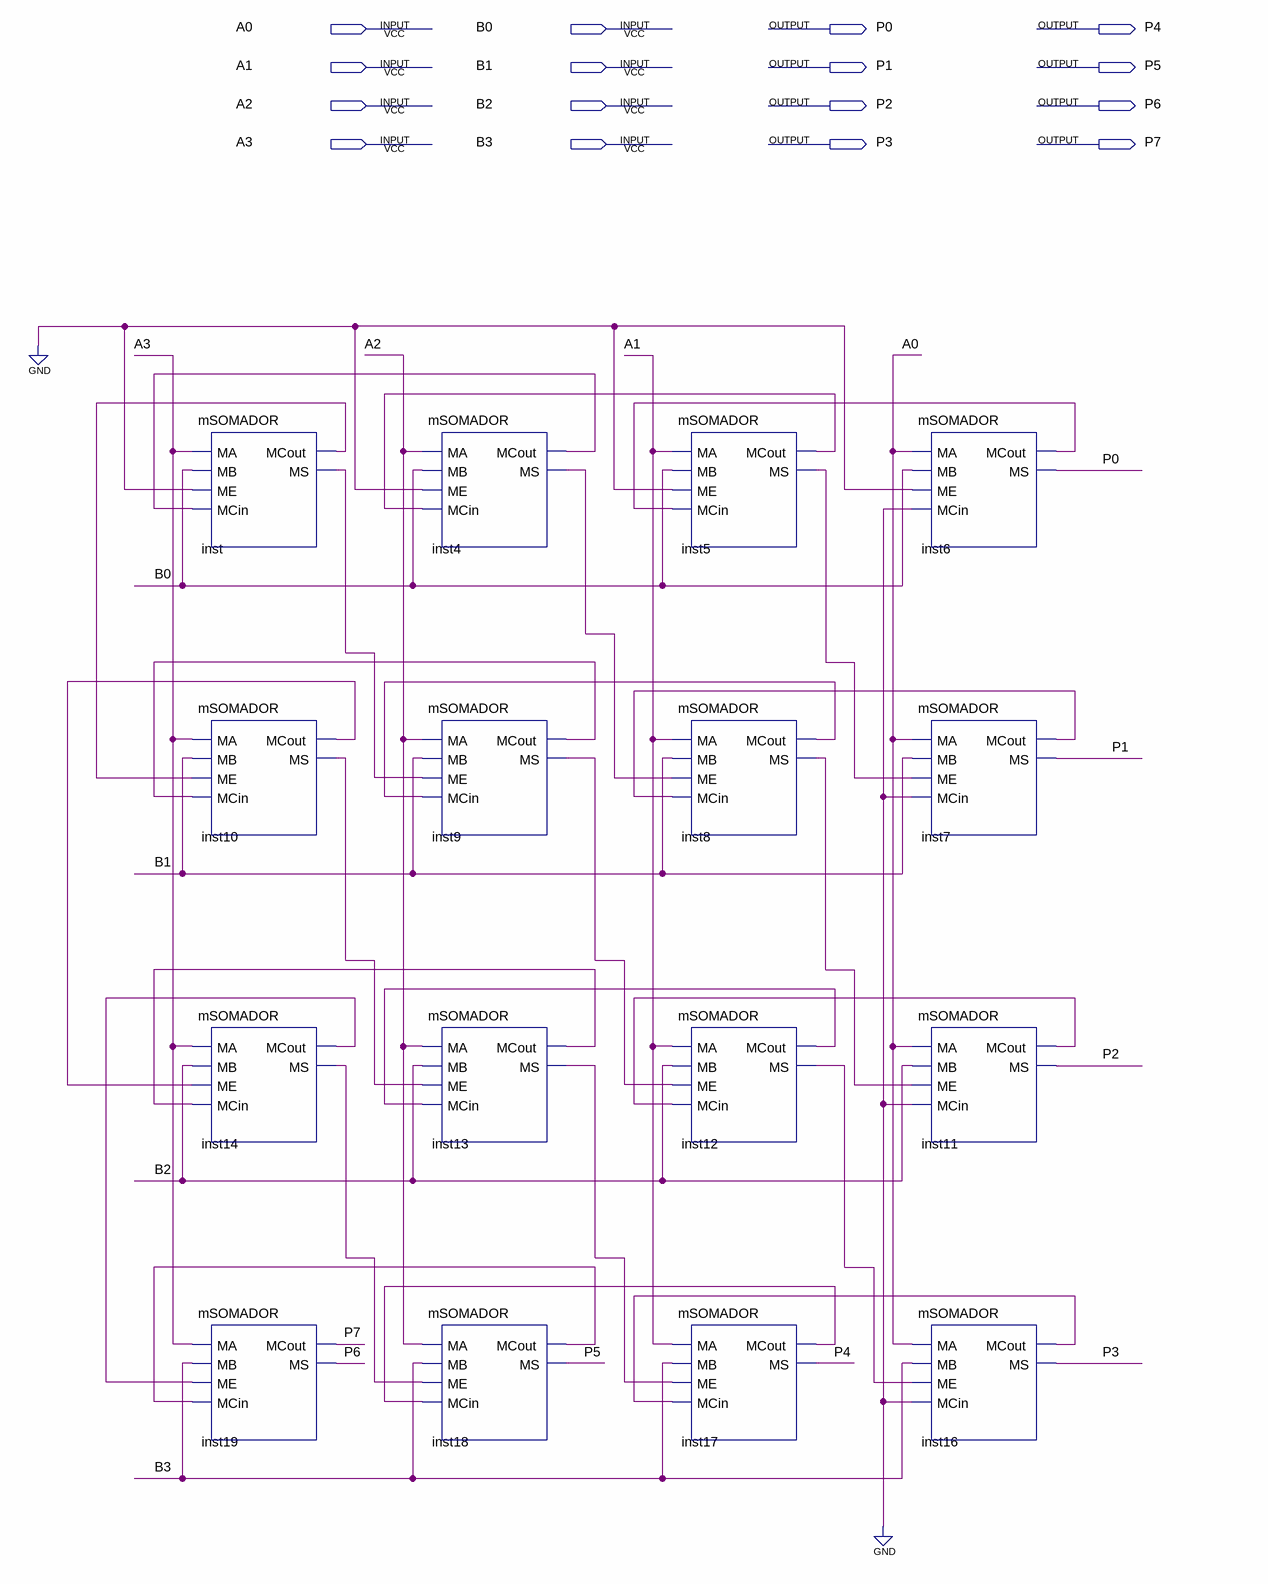
[diagram p0: schematic sheet]
// Quartus schematic multiplicador.bdf as structural Verilog: 16 symbols, 16 pins
module multiplicador (
  input  A0,
  input  B0,
  input  A1,
  input  B1,
  input  A2,
  input  B2,
  input  A3,
  input  B3,
  output P0,
  output P4,
  output P1,
  output P5,
  output P2,
  output P6,
  output P3,
  output P7
);

  wire inst4_mcout, inst4_ms, inst5_mcout, inst5_ms, inst6_mcout, inst7_mcout, inst8_mcout, inst8_ms,
       inst9_mcout, inst9_ms, inst10_mcout, inst10_ms, inst11_mcout, inst12_mcout, inst12_ms, inst13_mcout,
       inst13_ms, inst14_mcout, inst14_ms, inst16_mcout, inst17_mcout, inst18_mcout, inst_mcout, inst_ms;

  mSOMADOR inst (.MA(A3), .MB(B0), .ME(1'b0), .MCin(inst4_mcout), .MCout(inst_mcout), .MS(inst_ms));
  mSOMADOR inst10 (.MA(A3), .MB(B1), .ME(inst_mcout), .MCin(inst9_mcout), .MCout(inst10_mcout), .MS(inst10_ms));
  mSOMADOR inst14 (.MA(A3), .MB(B2), .ME(inst10_mcout), .MCin(inst13_mcout), .MCout(inst14_mcout), .MS(inst14_ms));
  mSOMADOR inst19 (.MA(A3), .MB(B3), .ME(inst14_mcout), .MCin(inst18_mcout), .MCout(P7), .MS(P6));
  mSOMADOR inst4 (.MA(A2), .MB(B0), .ME(1'b0), .MCin(inst5_mcout), .MCout(inst4_mcout), .MS(inst4_ms));
  mSOMADOR inst9 (.MA(A2), .MB(B1), .ME(inst_ms), .MCin(inst8_mcout), .MCout(inst9_mcout), .MS(inst9_ms));
  mSOMADOR inst13 (.MA(A2), .MB(B2), .ME(inst10_ms), .MCin(inst12_mcout), .MCout(inst13_mcout), .MS(inst13_ms));
  mSOMADOR inst18 (.MA(A2), .MB(B3), .ME(inst14_ms), .MCin(inst17_mcout), .MCout(inst18_mcout), .MS(P5));
  mSOMADOR inst5 (.MA(A1), .MB(B0), .ME(1'b0), .MCin(inst6_mcout), .MCout(inst5_mcout), .MS(inst5_ms));
  mSOMADOR inst8 (.MA(A1), .MB(B1), .ME(inst4_ms), .MCin(inst7_mcout), .MCout(inst8_mcout), .MS(inst8_ms));
  mSOMADOR inst12 (.MA(A1), .MB(B2), .ME(inst9_ms), .MCin(inst11_mcout), .MCout(inst12_mcout), .MS(inst12_ms));
  mSOMADOR inst17 (.MA(A1), .MB(B3), .ME(inst13_ms), .MCin(inst16_mcout), .MCout(inst17_mcout), .MS(P4));
  mSOMADOR inst6 (.MA(A0), .MB(B0), .ME(1'b0), .MCin(1'b0), .MCout(inst6_mcout), .MS(P0));
  mSOMADOR inst7 (.MA(A0), .MB(B1), .ME(inst5_ms), .MCin(1'b0), .MCout(inst7_mcout), .MS(P1));
  mSOMADOR inst11 (.MA(A0), .MB(B2), .ME(inst8_ms), .MCin(1'b0), .MCout(inst11_mcout), .MS(P2));
  mSOMADOR inst16 (.MA(A0), .MB(B3), .ME(inst12_ms), .MCin(1'b0), .MCout(inst16_mcout), .MS(P3));
endmodule
